# EAGLE schematic mr20adapter (EAGLE 7.5.0)
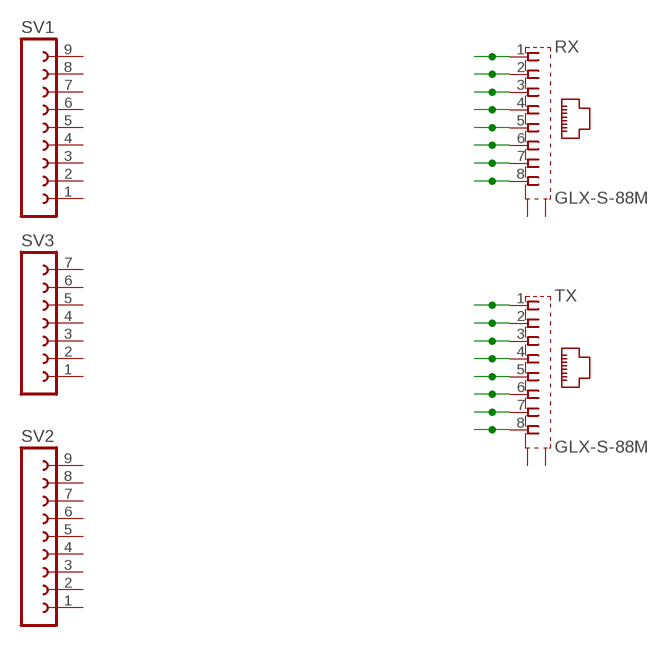
[diagram p0: schematic, sheet 1]

## Parts
RX  GLX-S-88M  [GLX-S-88M]
SV1  FE09-1  [FE09]
SV2  FE09-1  [FE09]
SV3  FE07-1  [FE07]
TX  GLX-S-88M  [GLX-S-88M]

## Nets
N$1: RX.1
N$2: RX.2
N$3: RX.3
N$4: RX.4
N$5: RX.5
N$6: RX.6
N$7: RX.7
N$8: RX.8
N$9: TX.1
N$10: TX.2
N$11: TX.3
N$12: TX.4
N$13: TX.5
N$14: TX.6
N$15: TX.7
N$16: TX.8
Unconnected: RX.S1 RX.S2 SV1.1 SV1.2 SV1.3 SV1.4 SV1.5 SV1.6 SV1.7 SV1.8 SV1.9 SV2.1 SV2.2 SV2.3 SV2.4 SV2.5 SV2.6 SV2.7 SV2.8 SV2.9 SV3.1 SV3.2 SV3.3 SV3.4 SV3.5 SV3.6 SV3.7 TX.S1 TX.S2

## Library data of the parts
RX TX = con-kycon:GLX-S-88M: Mod. Jack, Right Angle, 8 posiotion, 8 contatcs RJ45 Source: GLX-S-88M.pdf; OC_FARNELL: unknown; OC_NEWARK: unknown
SV1 SV2 = con-lsta:FE09-1: FEMALE HEADER; OC_FARNELL: unknown; OC_NEWARK: unknown
SV3 = con-lsta:FE07-1: FEMALE HEADER; OC_FARNELL: unknown; OC_NEWARK: unknown